# Altium schematic sheet STLINK PAVEL MOROZ.SchDoc
size A3; SheetNumber: 1; SheetTotal: 1
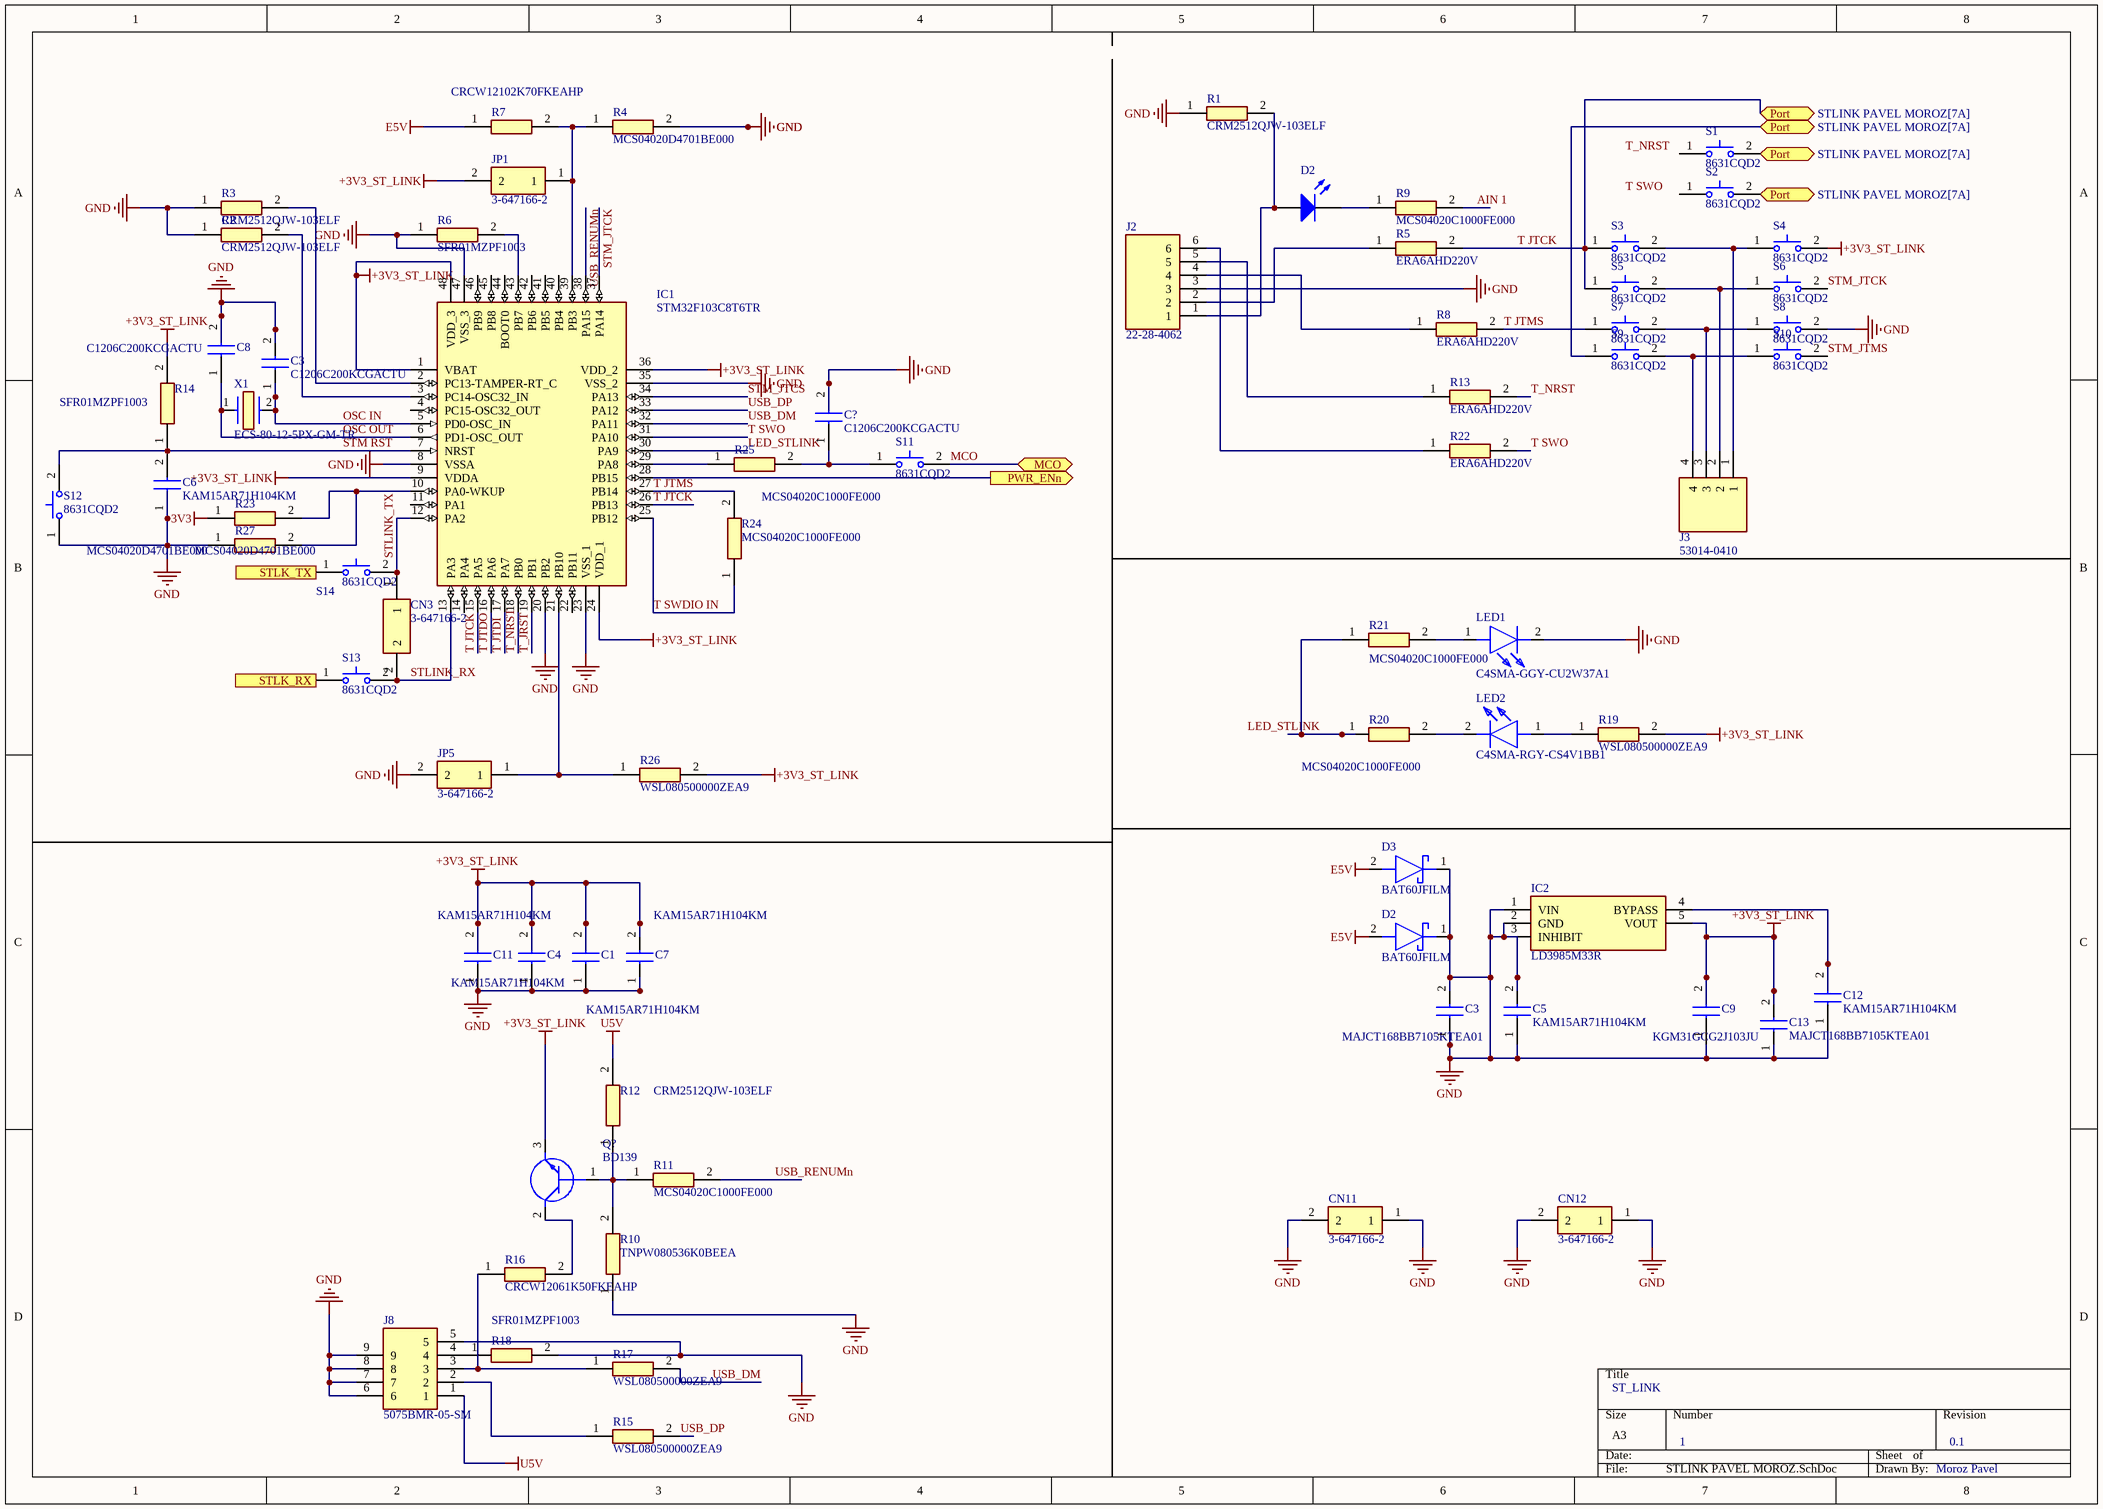
[diagram p0: STLINK PAVEL MOROZ.SchDoc]

## Parts
(Parts that share a designator on the sheet are numbered #1, #2 ... from top to bottom, then left to right.)
C1  KAM15AR71H104KM  [CAPC1608X90N]
C3#1  C1206C200KCGACTU  [C1206]
C3#2  MAJCT168BB7105KTEA01  [MAJx16]
C4  KAM15AR71H104KM  [CAPC1608X90N]
C5  KAM15AR71H104KM  [CAPC1608X90N]
C6  KAM15AR71H104KM  [CAPC1608X90N]
C7  KAM15AR71H104KM  [CAPC1608X90N]
C8  C1206C200KCGACTU  [C1206]
C9  KGM31GCG2J103JU  [CAPC3316X145N]
C11  KAM15AR71H104KM  [CAPC1608X90N]
C12  KAM15AR71H104KM  [CAPC1608X90N]
C13  MAJCT168BB7105KTEA01  [MAJx16]
C?  C1206C200KCGACTU  [C1206]
CN3  3-647166-2  [36471662]
CN11  3-647166-2  [36471662]
CN12  3-647166-2  [36471662]
D2#1  Light-Emitting Diode  (value not drawn)
D2#2  BAT60JFILM  [SOD2513X117N]
D3  BAT60JFILM  [SOD2513X117N]
IC1  STM32F103C8T6TR  [QFP50P900X900X160-48N]
IC2  LD3985M33R  [SOT95P280X145-5N]
J2  22-28-4062  [HDRV6W66P0X254_1X6_1524X249X838P]
J3  53014-0410  [SHDR4W60P0X200_1X4_1200X435X1000P]
J8  5075BMR-05-SM  [5075BMR05SM]
JP1  3-647166-2  [36471662]
JP5  3-647166-2  [36471662]
LED1  C4SMA-GGY-CU2W37A1  [C4SMAGGYCU2W37A1]
LED2  C4SMA-RGY-CS4V1BB1  [C4SMARGYCS4V1BB1]
Q?  BD139  [TO254P290X760X1320-3P]
R1  CRM2512QJW-103ELF  [RESC6331X80N]
R2  CRM2512QJW-103ELF  [RESC6331X80N]
R3  CRM2512QJW-103ELF  [RESC6331X80N]
R4  MCS04020D4701BE000  [RESC1005X37N]
R5  ERA6AHD220V  [ERA6AEB1020V]
R6  SFR01MZPF1003  [RESC1005X40N]
R7  CRCW12102K70FKEAHP  [RESC3225X70N]
R8  ERA6AHD220V  [ERA6AEB1020V]
R9  MCS04020C1000FE000  [RESC1005X37N]
R10  TNPW080536K0BEEA  [RESC2012X55N]
R11  MCS04020C1000FE000  [RESC1005X37N]
R12  CRM2512QJW-103ELF  [RESC6331X80N]
R13  ERA6AHD220V  [ERA6AEB1020V]
R14  SFR01MZPF1003  [RESC1005X40N]
R15  WSL080500000ZEA9  [RESC2013X84N]
R16  CRCW12061K50FKEAHP  [RESC3116X65N]
R17  WSL080500000ZEA9  [RESC2013X84N]
R18  SFR01MZPF1003  [RESC1005X40N]
R19  WSL080500000ZEA9  [RESC2013X84N]
R20  MCS04020C1000FE000  [RESC1005X37N]
R21  MCS04020C1000FE000  [RESC1005X37N]
R22  ERA6AHD220V  [ERA6AEB1020V]
R23  MCS04020D4701BE000  [RESC1005X37N]
R24  MCS04020C1000FE000  [RESC1005X37N]
R25  MCS04020C1000FE000  [RESC1005X37N]
R26  WSL080500000ZEA9  [RESC2013X84N]
R27  MCS04020D4701BE000  [RESC1005X37N]
S1  8631CQD2  [8631CQD2]
S2  8631CQD2  [8631CQD2]
S3  8631CQD2  [8631CQD2]
S4  8631CQD2  [8631CQD2]
S5  8631CQD2  [8631CQD2]
S6  8631CQD2  [8631CQD2]
S7  8631CQD2  [8631CQD2]
S8  8631CQD2  [8631CQD2]
S9  8631CQD2  [8631CQD2]
S10  8631CQD2  [8631CQD2]
S11  8631CQD2  [8631CQD2]
S12  8631CQD2  [8631CQD2]
S13  8631CQD2  [8631CQD2]
S14  8631CQD2  [8631CQD2]
X1  ECS-80-12-5PX-GM-TR  [ECS80125PXGMTR]

## Ports
MCO (bidir), Port (bidir, see STLINK PAVEL MOROZ[7A]), PWR_ENn (out), STLK_RX (in), STLK_TX (out)

## Nets
+3V3: R23.1
+3V3_ST_LINK: C1.2 C4.2 C7.2 C9.2 C11.2 C13.2 IC1.1(VBAT) IC1.9(VDDA) IC1.24(VDD_1) IC1.36(VDD_2) IC1.48(VDD_3) IC2.5(VOUT) JP1.2 Q?.3(E) R14.2 R19.2 R26.2 S4.2(N.O._2)
E5V: D2#2.2(A) D3.2(A) R7.1
GND: C1.1 C3#1.2 C3#2.1 C3#2.2 C4.1 C5.1 C5.2 C6.1 C7.1 C8.2 C9.1 C11.1 C12.1 C13.1 C?.2 CN11.1 CN11.2 CN12.1 CN12.2 D2#2.1(K) D3.1(K) IC1.8(VSSA) IC1.20(PB2) IC1.23(VSS_1) IC1.35(VSS_2) IC1.47(VSS_3) IC2.1(VIN) IC2.2(GND) IC2.3(INHIBIT) J2.3 J8.5 J8.6 J8.7 J8.8 J8.9 JP5.2 LED1.2(K) R1.1 R2.1 R3.1 R4.2 R6.1 R10.1 R18.2 R27.1 S8.2(N.O._2) S12.1(N.O._1)
U5V: J8.1 R12.2
AIN 1: R9.2
LED_STLINK: IC1.30(PA9)
MCO: S11.2(N.O._2) ; port MCO
OSC IN: C3#1.1 IC1.5(PD0-OSC_IN) X1.2
OSC OUT: C8.1 IC1.6(PD1-OSC_OUT) X1.1
PWR_ENn: IC1.28(PB15) ; port PWR_ENn
STLINK_RX: CN3.2 IC1.13(PA3) S13.2(N.O._2)
STLINK_TX: CN3.1 IC1.12(PA2) S14.2(N.O._2)
STLK_RX: S13.1(N.O._1) ; port STLK_RX
STLK_TX: S14.1(N.O._1) ; port STLK_TX
STM RST: C6.2 IC1.7(NRST) R14.1 S12.2(N.O._2)
STM_JTCK: IC1.37(PA14) S6.2(N.O._2)
STM_JTCS: IC1.34(PA13)
STM_JTMS: S10.2(N.O._2)
T JTCK: IC1.15(PA5) IC1.26(PB13) R5.2 S1.2(N.O._2) S2.2(N.O._2) S3.1(N.O._1) S5.1(N.O._1) S9.1(N.O._1) ; port Port
T JTDI: IC1.17(PA7)
T JTDO: IC1.16(PA6)
T JTMS: IC1.27(PB14) R8.2 R24.2 S7.1(N.O._1)
T SWDIO IN: IC1.25(PB12) R24.1
T SWO: IC1.31(PA10) R22.2
T_JRST: IC1.19(PB1)
T_NRST: IC1.18(PB0) R13.2
USB_DM: IC1.32(PA11) R17.2
USB_DP: IC1.33(PA12) R15.2
USB_RENUMn: IC1.38(PA15) R11.2
NetC12_2: C12.2 IC2.4(BYPASS)
NetC?_1: C?.1 R25.2 S11.1(N.O._1)
NetD2#1_1: D2#1.1(A) J2.1 R1.2
NetD2#1_2: D2#1.2(K) R9.1
NetIC1_2: IC1.2(PC13-TAMPER-RT_C) R3.2
NetIC1_3: IC1.3(PC14-OSC32_IN) R2.2
NetIC1_10: IC1.10(PA0-WKUP) R23.2 R27.2
NetIC1_21: IC1.21(PB10) JP5.1 R26.1
NetIC1_29: IC1.29(PA8) R25.1
NetIC1_39: IC1.39(PB3) JP1.1 R4.1 R7.2
NetIC1_43: IC1.43(PB7) R6.2
NetJ2_2: J2.2 R5.1
NetJ2_4: J2.4 R8.1
NetJ2_5: J2.5 R13.1
NetJ2_6: J2.6 R22.1
NetJ3_1: J3.1 S3.2(N.O._2) S4.1(N.O._1)
NetJ3_2: J3.2 S5.2(N.O._2) S6.1(N.O._1)
NetJ3_3: J3.3 S7.2(N.O._2) S8.1(N.O._1)
NetJ3_4: J3.4 S9.2(N.O._2) S10.1(N.O._1)
NetJ8_2: J8.2 R15.1
NetJ8_3: J8.3 R16.1 R17.1
NetJ8_4: J8.4 R18.1
NetLED1_1: LED1.1(A) R21.2
NetLED2_1: LED2.1(A) R19.1
NetLED2_2: LED2.2(K) R20.2
NetQ?_1: Q?.1(B) R10.2 R11.1 R12.1
NetQ?_2: Q?.2(C) R16.2
NetR20_1: R20.1 R21.1

Not connected (* = marked no-connect by the designer): IC1 4(PC15-OSC32_OUT) 11(PA1) 14(PA4) 22(PB11) 40(PB4) 41(PB5) 42(PB6) 44(BOOT0) 45(PB8) 46(PB9); S1 1(N.O._1); S2 1(N.O._1)

## Notes on the sheet
- ST_LINK
- 1
- 0.1
- Moroz Pavel
- Labels drawn without touching a wire or pin: LED_STLINK, T SWO, T_NRST

## Library data of the parts
C1 C4-C7 C11 C12 = KAM15AR71H104KM: Capacitor; Manufacturer_Name: Kyocera AVX; Datasheet Link: https://datasheets.kyocera-avx.com/AutoMLCCKAM.pdf; Height: 0.9mm; Manufacturer_Part_Number: KAM15AR71H104KM; Mouser Part Number: 581-KAM15AR71H104KM; Mouser Price/Stock: https://www.mouser.co.uk/ProductDetail/KYOCERA-AVX/KAM15AR71H104KM?qs=Jm2GQyTW%2FbgzS5FHJWrFzQ%3D%3D; Arrow Part Number: KAM15AR71H104KM; Arrow Price/Stock: https://www.arrow.com/en/products/kam15ar71h104km/avx?region=nac
C3#1 C8 C? = C1206C200KCGACTU: Capacitor; Manufacturer_Name: KEMET; Datasheet Link: https://content.kemet.com/datasheets/KEM_C1009_C0G_HV_SMD.pdf; Manufacturer_Part_Number: C1206C200KCGACTU
C3#2 C13 = MAJCT168BB7105KTEA01: Capacitor; Manufacturer_Name: TAIYO YUDEN; Datasheet Link: https://ds.yuden.co.jp/TYCOMPAS/or/detail?pn=MAJCT168BB7105KTEA01; Height: 0.8mm; Manufacturer_Part_Number: MAJCT168BB7105KTEA01
C9 = KGM31GCG2J103JU: Capacitor; Manufacturer_Name: Kyocera AVX; Datasheet Link: https://datasheets.kyocera-avx.com/HVKGM.pdf; Height: 1.45mm; Manufacturer_Part_Number: KGM31GCG2J103JU; Mouser Part Number: 581-KGM31GCG2J103JU; Mouser Price/Stock: https://www.mouser.co.uk/ProductDetail/KYOCERA-AVX/KGM31GCG2J103JU?qs=63Lh8XYXgjt6ivbLeGkCxg%3D%3D
CN3 CN11 CN12 JP1 JP5 = 3-647166-2: Connector; Manufacturer_Name: TE Connectivity; Datasheet Link: https://www.te.com/commerce/DocumentDelivery/DDEController?Action=showdoc&DocId=Customer+Drawing%7F647166%7FR1%7Fpdf%7FEnglish%7FENG_CD_647166_R1.pdf%7F3-647166-2; Height: 10.66mm; Manufacturer_Part_Number: 3-647166-2; Mouser Part Number: 571-3-647166-2; Mouser Price/Stock: https://www.mouser.co.uk/ProductDetail/TE-Connectivity/3-647166-2?qs=xsTFCgGnzbJU1qz6Np9kzA%3D%3D; Arrow Part Number: 3-647166-2; Arrow Price/Stock: https://www.arrow.com/en/products/3-647166-2/te-connectivity?region=nac
D2#1 = LED: AF: 1; BV: 0; BV_MAX: 1e99; EG: 1.11; FC: 0.5; IBV: 0.001; IS: 1e-14; MJSW: 0.33; NTUN: 30; TNOM: 27; XTI: 3; SimulationGenericComponent: True; CJO: 0; CJP: 0; CTA: 0; CTP: 0; FCS: 0.5; FV_MAX: 1e99; IKF: 0; IKR: 0; ISR: 1e-14; JSW: 0; JTUN: 0; JTUNSW: 0; KEG: 1; KF: 0; LEVEL: 1; N: 1; NBV: 1; NR: 1; NS: 1; PHP: 1; RS: 0; TCV: 0; TLEV: 0; TLEVC: 0; TM1: 0; TM2: 0; TPB: 0; TPHP: 0; TRS: 0; TRS2: 0; TT: 0; TTT1: 0; TTT2: 0; VJ: 1; XTITUN: 3
D2#2 D3 = BAT60JFILM: Schottky Diode; Manufacturer_Name: STMicroelectronics; Datasheet Link: https://www.mouser.jp/datasheet/2/389/cd00001944-1795661.pdf; Height: 1.17mm; Manufacturer_Part_Number: BAT60JFILM; Mouser Part Number: 511-BAT60JFILM; Mouser Price/Stock: https://www.mouser.co.uk/ProductDetail/STMicroelectronics/BAT60JFILM?qs=GnFZssByvVVVnMaukcyLZg%3D%3D; Arrow Part Number: BAT60JFILM; Arrow Price/Stock: https://www.arrow.com/en/products/bat60jfilm/stmicroelectronics?region=nac
IC1 = STM32F103C8T6TR: Integrated Circuit; Manufacturer_Name: STMicroelectronics; Datasheet Link: http://media.digikey.com/pdf/Data%20Sheets/ST%20Microelectronics%20PDFS/STM32F103x8,B.pdf; Height: 1.6mm; Manufacturer_Part_Number: STM32F103C8T6TR; Mouser Part Number: 511-STM32F103C8T6TR; Mouser Price/Stock: https://www.mouser.co.uk/ProductDetail/STMicroelectronics/STM32F103C8T6TR?qs=5HwTSiuA5HDxFj62n06yag%3D%3D; Arrow Part Number: STM32F103C8T6TR; Arrow Price/Stock: https://www.arrow.com/en/products/stm32f103c8t6tr/stmicroelectronics?region=nac
IC2 = LD3985M33R: Integrated Circuit; Manufacturer_Name: STMicroelectronics; Datasheet Link: http://www.st.com/st-web-ui/static/active/en/resource/technical/document/datasheet/CD00003395.pdf; Height: 1.45mm; Manufacturer_Part_Number: LD3985M33R; Mouser Part Number: 511-LD3985M33R; Mouser Price/Stock: https://www.mouser.co.uk/ProductDetail/STMicroelectronics/LD3985M33R?qs=22WmWNTp1rrPOccVv4HZ7A%3D%3D; Arrow Part Number: LD3985M33R; Arrow Price/Stock: https://www.arrow.com/en/products/ld3985m33r/stmicroelectronics?region=europe
J2 = 22-28-4062: Connector; Manufacturer_Name: Molex; Datasheet Link: https://datasheet.datasheetarchive.com/originals/distributors/SFDatasheet-1/sf-00031037.pdf; Height: 8.38mm; Manufacturer_Part_Number: 22-28-4062; Mouser Part Number: 538-22-28-4062; Mouser Price/Stock: https://www.mouser.com/Search/Refine.aspx?Keyword=538-22-28-4062
J3 = 53014-0410: Connector; Manufacturer_Name: Molex; Datasheet Link: https://www.molex.com/pdm_docs/sd/530140410_sd.pdf; Height: 10mm; Manufacturer_Part_Number: 53014-0410; Mouser Part Number: 538-53014-0410; Mouser Price/Stock: https://www.mouser.co.uk/ProductDetail/Molex/53014-0410?qs=TLs3Kb%252BkMqKk8s1WRHwRGw%3D%3D
J8 = 5075BMR-05-SM: Connector; Manufacturer_Name: NELTRON; Datasheet Link: http://www.ibselectronics.com/ibsstore/datasheet/5075BMR-05-SM-CR.pdf; Height: 4mm; Manufacturer_Part_Number: 5075BMR-05-SM
LED1 = C4SMA-GGY-CU2W37A1: LED; Manufacturer_Name: CREE LED; Datasheet Link: https://cree-led.com/media/documents/C4SMA-1442.pdf; Height: 8.8mm; Manufacturer_Part_Number: C4SMA-GGY-CU2W37A1; Mouser Part Number: 941-C4SMAGGYCU2W37A1; Mouser Price/Stock: https://www.mouser.co.uk/ProductDetail/Cree-LED/C4SMA-GGY-CU2W37A1?qs=7D1LtPJG0i1gnYL5Rh9Mjg%3D%3D
LED2 = C4SMA-RGY-CS4V1BB1: LED; Manufacturer_Name: CREE LED; Datasheet Link: https://cree-led.com/media/documents/C4SMA-1442.pdf; Height: 8.8mm; Manufacturer_Part_Number: C4SMA-RGY-CS4V1BB1; Mouser Part Number: 941-C4SMARGYCS4V1BB1; Mouser Price/Stock: https://www.mouser.co.uk/ProductDetail/Cree-LED/C4SMA-RGY-CS4V1BB1?qs=7D1LtPJG0i08%2Fw1qRIcnyw%3D%3D; Arrow Part Number: C4SMA-RGY-CS4V1BB1; Arrow Price/Stock: https://www.arrow.com/en/products/c4sma-rgy-cs4v1bb1/cree-led?region=nac
Q? = BD139: Transistor BJT NPN; Manufacturer_Name: STMicroelectronics; Datasheet Link: http://www.st.com/web/en/resource/technical/document/datasheet/CD00001225.pdf; Height: 2.9mm; Manufacturer_Part_Number: BD139; Mouser Part Number: 511-BD139; Mouser Price/Stock: https://www.mouser.co.uk/ProductDetail/STMicroelectronics/BD139?qs=ljbEvF4DwOPW%2FLxHSWYMMA%3D%3D; Arrow Part Number: BD139; Arrow Price/Stock: https://www.arrow.com/en/products/bd139/stmicroelectronics?region=europe
R1-R3 R12 = CRM2512QJW-103ELF: Resistor; Manufacturer_Name: Bourns; Datasheet Link: http://www.bourns.com/data/global/pdfs/CRM0805_1206_2010.pdf; Height: 0.8mm; Manufacturer_Part_Number: CRM2512QJW-103ELF; Mouser Part Number: 652-CRM2512QJW-103E; Mouser Price/Stock: https://www.mouser.co.uk/ProductDetail/Bourns/CRM2512QJW-103ELF?qs=8Wlm6%252BaMh8Rzg3bRHdWGsA%3D%3D; Arrow Part Number: CRM2512QJW-103ELF; Arrow Price/Stock: https://www.arrow.com/en/products/crm2512qjw-103elf/bourns?region=nac
R4 R23 R27 = MCS04020D4701BE000: Resistor; Manufacturer_Name: Vishay; Datasheet Link: http://www.vishay.com/docs/28705/mcx0x0xpro.pdf; Height: 0.37mm; Manufacturer_Part_Number: MCS04020D4701BE000; Mouser Part Number: 594-MCS04020D4701BE0; Mouser Price/Stock: https://www.mouser.co.uk/ProductDetail/Vishay-Beyschlag/MCS04020D4701BE000?qs=ft9OtscSA3%252BR0DpF5QqL2Q%3D%3D
R5 R8 R13 R22 = ERA6AHD220V: Resistor; Manufacturer_Name: Panasonic; Datasheet Link: https://industrial.panasonic.com/cdbs/www-data/pdf/RDM0000/AOA0000C307.pdf; Height: 0.6mm; Manufacturer_Part_Number: ERA6AHD220V
R6 R14 R18 = SFR01MZPF1003: Resistor; Manufacturer_Name: ROHM Semiconductor; Datasheet Link: https://fscdn.rohm.com/en/products/databook/datasheet/passive/resistor/chip_resistor/sfr-e.pdf; Height: 0.4mm; Manufacturer_Part_Number: SFR01MZPF1003; Mouser Part Number: 755-SFR01MZPF1003; Mouser Price/Stock: https://www.mouser.co.uk/ProductDetail/ROHM-Semiconductor/SFR01MZPF1003?qs=Mv7BduZupUj2RFL5gMaKTg%3D%3D
R7 = CRCW12102K70FKEAHP: Resistor; Manufacturer_Name: Vishay; Datasheet Link: http://componentsearchengine.com/Datasheets/1/CRCW12102K70FKEAHP.pdf; Height: 0.7mm; Manufacturer_Part_Number: CRCW12102K70FKEAHP; Mouser Part Number: 71-CRCW12102K70FKEAH; Mouser Price/Stock: https://www.mouser.co.uk/ProductDetail/Vishay-Dale/CRCW12102K70FKEAHP?qs=OAzHGkhREL0m0%252BU1n6AaAg%3D%3D
R9 R11 R20 R21 R24 R25 = MCS04020C1000FE000: Resistor; Manufacturer_Name: Vishay; Datasheet Link: http://www.vishay.com/docs/28705/mcx0x0xpro.pdf; Height: 0.37mm; Manufacturer_Part_Number: MCS04020C1000FE000; Mouser Part Number: 594-MCS04020C1000FE0; Mouser Price/Stock: https://www.mouser.co.uk/ProductDetail/Vishay-Beyschlag/MCS04020C1000FE000?qs=7ZE6F4QMOBYkwvQlfbkT8w%3D%3D; Arrow Part Number: MCS04020C1000FE000; Arrow Price/Stock: https://www.arrow.com/en/products/mcs04020c1000fe000/vishay
R10 = TNPW080536K0BEEA: Resistor; Manufacturer_Name: Vishay; Datasheet Link: https://www.vishay.com/docs/31006/tnpw.pdf; Height: 0.55mm; Manufacturer_Part_Number: TNPW080536K0BEEA
R15 R17 R19 R26 = WSL080500000ZEA9: Resistor; Manufacturer_Name: Vishay; Datasheet Link: https://ad.componentsearchengine.com/Datasheets/2/WSL080500000ZEA9.pdf; Height: 0.838mm; Manufacturer_Part_Number: WSL080500000ZEA9; Mouser Part Number: 71-WSL080500000ZEA9; Mouser Price/Stock: https://www.mouser.co.uk/ProductDetail/Vishay-Dale/WSL080500000ZEA9?qs=f1l5vAGoKgsImKS87N8TmQ%3D%3D; Arrow Part Number: WSL080500000ZEA9; Arrow Price/Stock: https://www.arrow.com/en/products/wsl080500000zea9/vishay?region=nac
R16 = CRCW12061K50FKEAHP: Resistor; Manufacturer_Name: Vishay; Datasheet Link: http://componentsearchengine.com/Datasheets/1/CRCW12061K50FKEAHP.pdf; Height: 0.65mm; Manufacturer_Part_Number: CRCW12061K50FKEAHP; Mouser Part Number: 71-CRCW12061K50FKEAH; Mouser Price/Stock: https://www.mouser.co.uk/ProductDetail/Vishay-Dale/CRCW12061K50FKEAHP?qs=k2%2FDWSARqgEwHXAQbL4aEg%3D%3D; Arrow Part Number: CRCW12061K50FKEAHP; Arrow Price/Stock: https://www.arrow.com/en/products/crcw12061k50fkeahp/vishay?region=nac
S1-S14 = 8631CQD2: Switch (2-Pin Push); Manufacturer_Name: C & K COMPONENTS; Datasheet Link: https://www.ckswitches.com/media/1396/8600.pdf; Height: 13.93mm; Manufacturer_Part_Number: 8631CQD2; Mouser Part Number: 611-8631-261; Mouser Price/Stock: https://www.mouser.co.uk/ProductDetail/CK/8631CQD2?qs=ktcBc77oICXe9iPhfEwnkA%3D%3D
X1 = ECS-80-12-5PX-GM-TR: Crystal or Oscillator; Manufacturer_Name: ECS; Datasheet Link: https://ecsxtal.com/store/pdf/csm-7x.pdf; Height: 4.3mm; Manufacturer_Part_Number: ECS-80-12-5PX-GM-TR; Mouser Part Number: 520-80-12-5PX-GM-TR; Mouser Price/Stock: https://www.mouser.co.uk/ProductDetail/ECS/ECS-80-12-5PX-GM-TR?qs=amGC7iS6iy%252BwzUdIY7WpOA%3D%3D